# EAGLE schematic Quad_ESC_adapter (EAGLE 9.6.2)
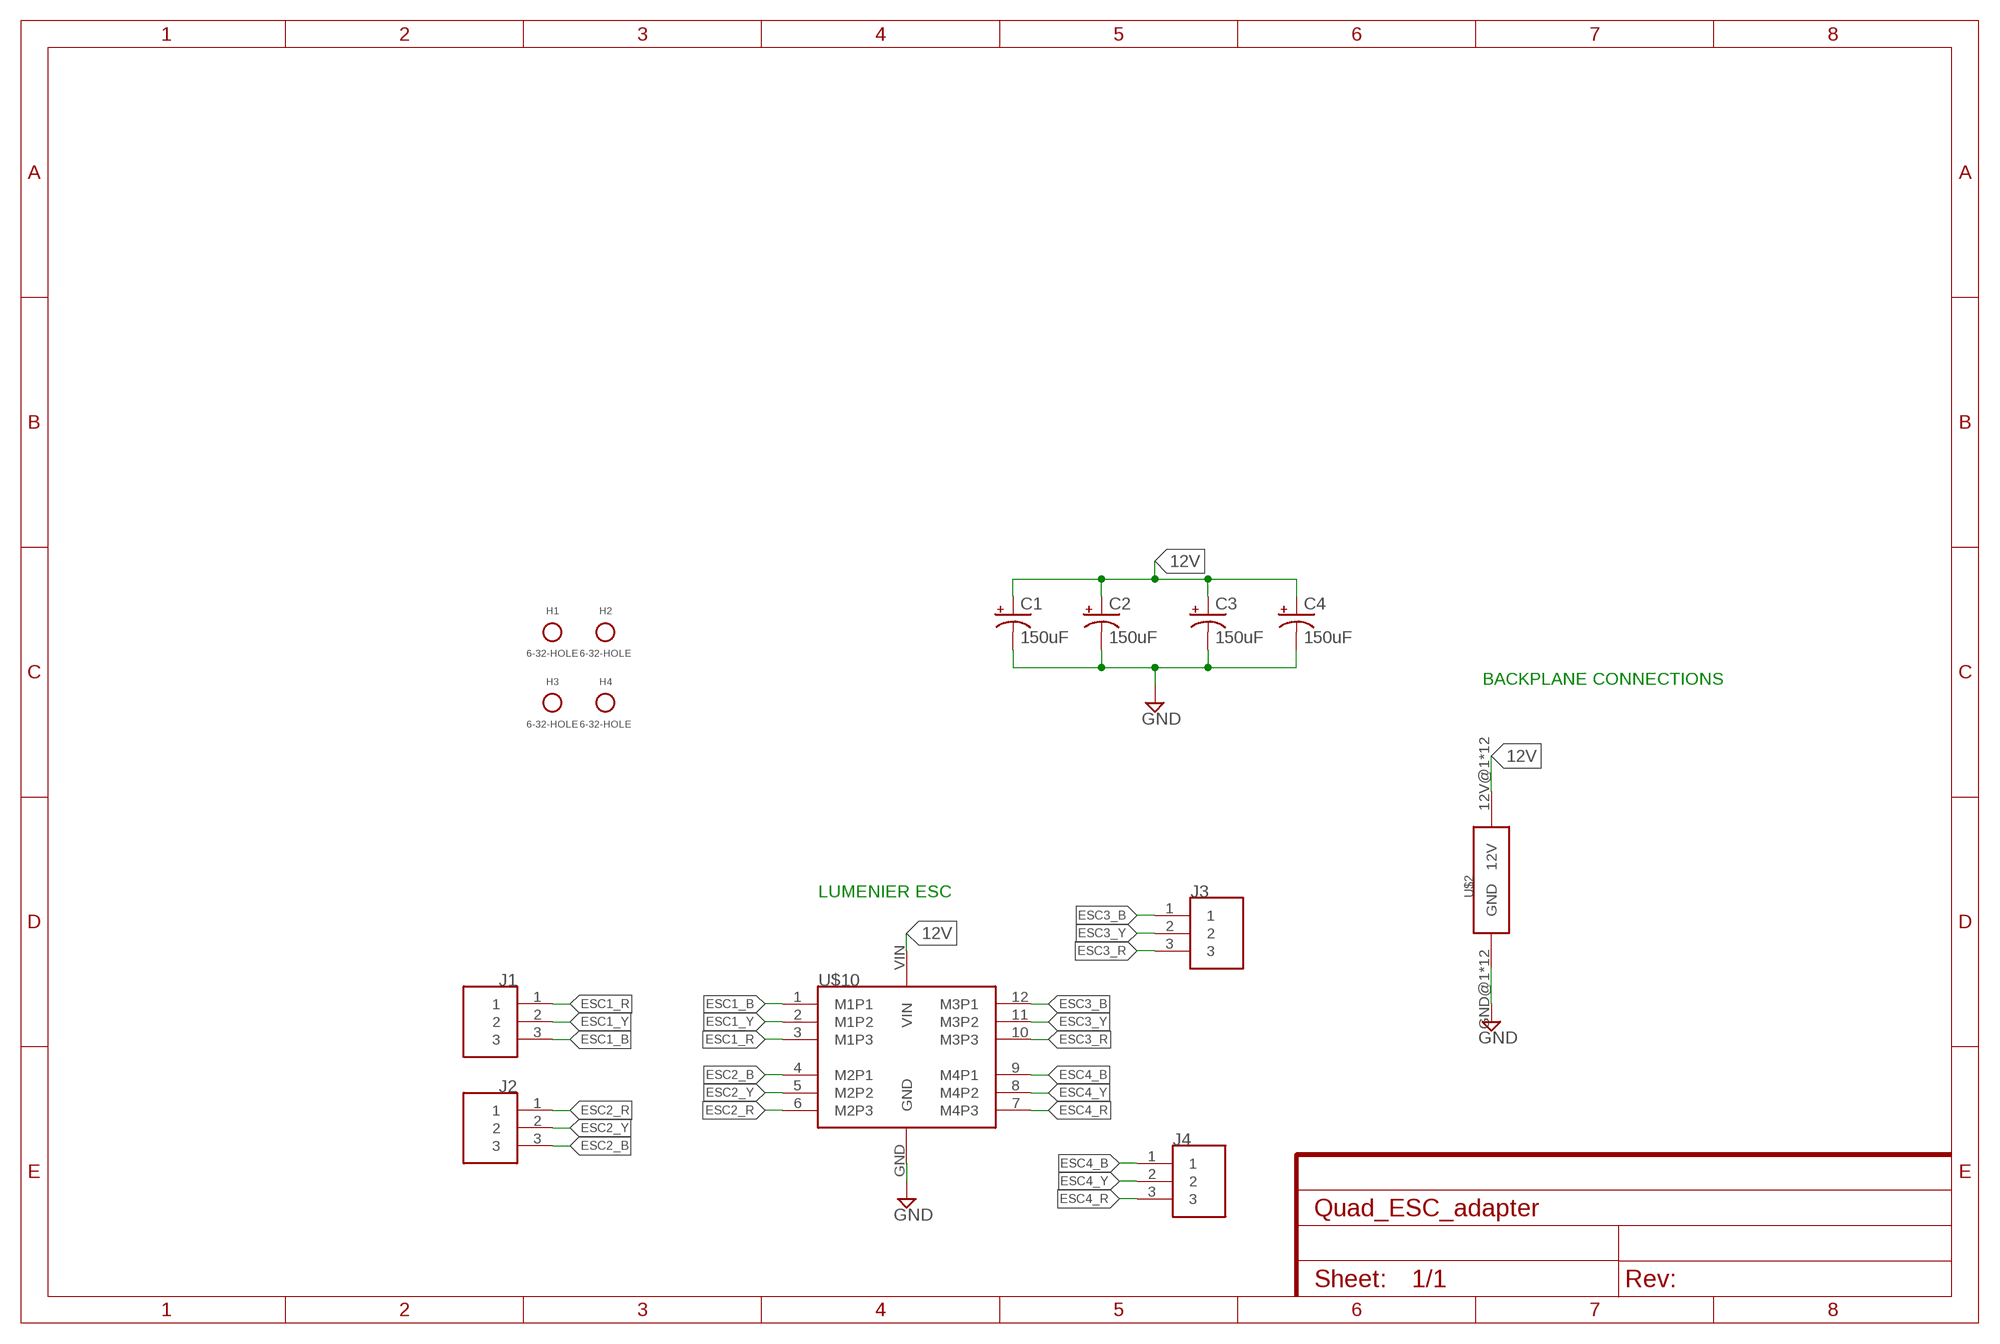
[diagram p0: schematic, sheet 1]

## Parts
C1  150uF  C-TANTALUM(10UF_150UF)  [2917(7343-31-METRIC)]
C2  150uF  C-TANTALUM(10UF_150UF)  [2917(7343-31-METRIC)]
C3  150uF  C-TANTALUM(10UF_150UF)  [2917(7343-31-METRIC)]
C4  150uF  C-TANTALUM(10UF_150UF)  [2917(7343-31-METRIC)]
H1  6-32-HOLE  [6-32-HOLE]
H2  6-32-HOLE  [6-32-HOLE]
H3  6-32-HOLE  [6-32-HOLE]
H4  6-32-HOLE  [6-32-HOLE]
J1  284512-3  [284512-3]
J2  284512-3  [284512-3]
J3  284512-3  [284512-3]
J4  284512-3  [284512-3]
U$2  BACKPLANE_ESC_ADAPTER_PWRESC  [BACKPLANE_ESC_ADAPTER_ESC_PWR]
U$10  LUMENIER_QUAD-NO-CUT  [LUMENIER_QUAD-NO-CUT]

## Nets
12V: C1.+ C2.+ C3.+ C4.+ U$2.12V@1(12V) U$2.12V@2(12V) U$2.12V@3(12V) U$2.12V@4(12V) U$2.12V@5(12V) U$2.12V@6(12V) U$2.12V@7(12V) U$2.12V@8(12V) U$2.12V@9(12V) U$2.12V@10(12V) U$2.12V@11(12V) U$2.12V@12(12V) U$10.VIN
ESC1_B: J1.3 U$10.1(M1P1)
ESC1_R: J1.1 U$10.3(M1P3)
ESC1_Y: J1.2 U$10.2(M1P2)
ESC2_B: J2.3 U$10.4(M2P1)
ESC2_R: J2.1 U$10.6(M2P3)
ESC2_Y: J2.2 U$10.5(M2P2)
ESC3_B: J3.1 U$10.12(M3P1)
ESC3_R: J3.3 U$10.10(M3P3)
ESC3_Y: J3.2 U$10.11(M3P2)
ESC4_B: J4.1 U$10.9(M4P1)
ESC4_R: J4.3 U$10.7(M4P3)
ESC4_Y: J4.2 U$10.8(M4P2)
GND: C1.- C2.- C3.- C4.- U$2.GND@1(GND) U$2.GND@2(GND) U$2.GND@3(GND) U$2.GND@4(GND) U$2.GND@5(GND) U$2.GND@6(GND) U$2.GND@7(GND) U$2.GND@8(GND) U$2.GND@9(GND) U$2.GND@10(GND) U$2.GND@11(GND) U$2.GND@12(GND) U$10.GND

## Notes on the sheet
- BACKPLANE CONNECTIONS
- LUMENIER ESC

## Library data of the parts
C1-C4 = Tantalum Cap 150 uF - Kemet 2917 T491:C-TANTALUM(10UF_150UF)
H1-H4 = Mounting Holes:6-32-HOLE
J1-J4 = ThrusterConnector:284512-3
U$2 = Backplane_ESC_adapter:BACKPLANE_ESC_ADAPTER_PWR
U$10 = Lumenier ESC:LUMENIER_QUAD-NO-CUT